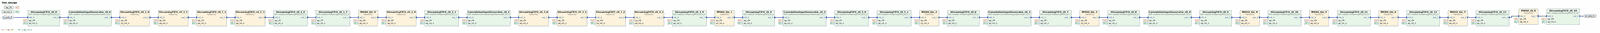
[diagram p0: block diagram of the top level, whole]
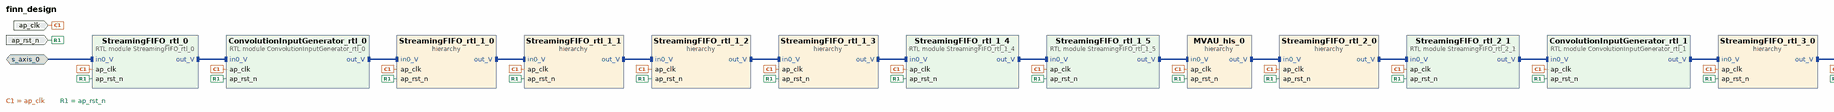
[diagram p1: block diagram of the top level, left part]
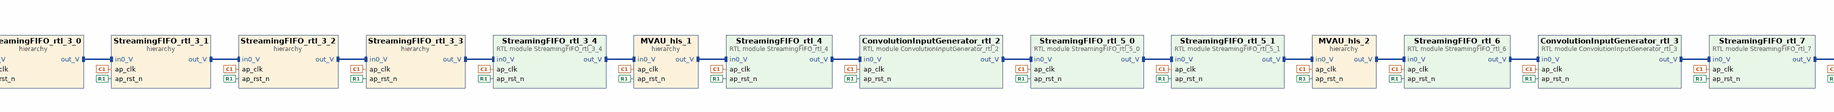
[diagram p2: block diagram of the top level, centre part]
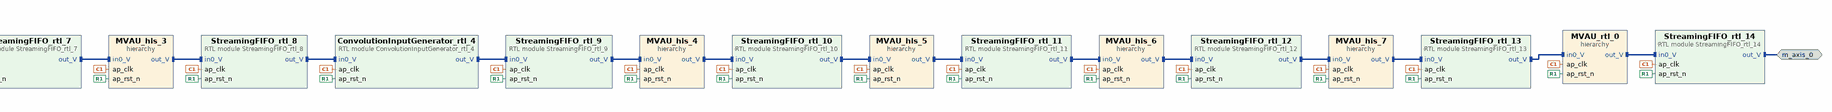
[diagram p3: block diagram of the top level, right part]
# Vivado block design finn_design, xc7s25csga225-1, Vivado 2024.2
create_bd_design finn_design

create_bd_intf_port -mode Slave -vlnv xilinx.com:interface:axis_rtl:1.0 s_axis_0
set_property -dict [list \
  CONFIG.FREQ_HZ 83333333 \
  CONFIG.HAS_TKEEP 0 \
  CONFIG.HAS_TLAST 0 \
  CONFIG.HAS_TREADY 1 \
  CONFIG.HAS_TSTRB 0 \
  CONFIG.LAYERED_METADATA undef \
  CONFIG.TDATA_NUM_BYTES 1 \
  CONFIG.TDEST_WIDTH 0 \
  CONFIG.TID_WIDTH 0 \
  CONFIG.TUSER_WIDTH 0 \
] [get_bd_intf_ports s_axis_0]
create_bd_intf_port -mode Master -vlnv xilinx.com:interface:axis_rtl:1.0 m_axis_0
set_property -dict {CONFIG.FREQ_HZ 83333333} [get_bd_intf_ports m_axis_0]
create_bd_port -dir I -type clk ap_clk
set_property -dict {CONFIG.FREQ_HZ 83333333} [get_bd_ports ap_clk]
create_bd_port -dir I -type rst ap_rst_n

create_bd_cell -type module -reference StreamingFIFO_rtl_0 StreamingFIFO_rtl_0
create_bd_cell -type module -reference ConvolutionInputGenerator_rtl_0 ConvolutionInputGenerator_rtl_0
create_bd_cell -type hier StreamingFIFO_rtl_1_0
create_bd_cell -type hier StreamingFIFO_rtl_1_1
create_bd_cell -type hier StreamingFIFO_rtl_1_2
create_bd_cell -type hier StreamingFIFO_rtl_1_3
create_bd_cell -type module -reference StreamingFIFO_rtl_1_4 StreamingFIFO_rtl_1_4
create_bd_cell -type module -reference StreamingFIFO_rtl_1_5 StreamingFIFO_rtl_1_5
create_bd_cell -type hier MVAU_hls_0
create_bd_cell -type hier StreamingFIFO_rtl_2_0
create_bd_cell -type module -reference StreamingFIFO_rtl_2_1 StreamingFIFO_rtl_2_1
create_bd_cell -type module -reference ConvolutionInputGenerator_rtl_1 ConvolutionInputGenerator_rtl_1
create_bd_cell -type hier StreamingFIFO_rtl_3_0
create_bd_cell -type hier StreamingFIFO_rtl_3_1
create_bd_cell -type hier StreamingFIFO_rtl_3_2
create_bd_cell -type hier StreamingFIFO_rtl_3_3
create_bd_cell -type module -reference StreamingFIFO_rtl_3_4 StreamingFIFO_rtl_3_4
create_bd_cell -type hier MVAU_hls_1
create_bd_cell -type module -reference StreamingFIFO_rtl_4 StreamingFIFO_rtl_4
create_bd_cell -type module -reference ConvolutionInputGenerator_rtl_2 ConvolutionInputGenerator_rtl_2
create_bd_cell -type module -reference StreamingFIFO_rtl_5_0 StreamingFIFO_rtl_5_0
create_bd_cell -type module -reference StreamingFIFO_rtl_5_1 StreamingFIFO_rtl_5_1
create_bd_cell -type hier MVAU_hls_2
create_bd_cell -type module -reference StreamingFIFO_rtl_6 StreamingFIFO_rtl_6
create_bd_cell -type module -reference ConvolutionInputGenerator_rtl_3 ConvolutionInputGenerator_rtl_3
create_bd_cell -type module -reference StreamingFIFO_rtl_7 StreamingFIFO_rtl_7
create_bd_cell -type hier MVAU_hls_3
create_bd_cell -type module -reference StreamingFIFO_rtl_8 StreamingFIFO_rtl_8
create_bd_cell -type module -reference ConvolutionInputGenerator_rtl_4 ConvolutionInputGenerator_rtl_4
create_bd_cell -type module -reference StreamingFIFO_rtl_9 StreamingFIFO_rtl_9
create_bd_cell -type hier MVAU_hls_4
create_bd_cell -type module -reference StreamingFIFO_rtl_10 StreamingFIFO_rtl_10
create_bd_cell -type hier MVAU_hls_5
create_bd_cell -type module -reference StreamingFIFO_rtl_11 StreamingFIFO_rtl_11
create_bd_cell -type hier MVAU_hls_6
create_bd_cell -type module -reference StreamingFIFO_rtl_12 StreamingFIFO_rtl_12
create_bd_cell -type hier MVAU_hls_7
create_bd_cell -type module -reference StreamingFIFO_rtl_13 StreamingFIFO_rtl_13
create_bd_cell -type hier MVAU_rtl_0
create_bd_cell -type module -reference StreamingFIFO_rtl_14 StreamingFIFO_rtl_14

# ---- hierarchy /StreamingFIFO_rtl_1_0 ----
current_bd_instance /StreamingFIFO_rtl_1_0
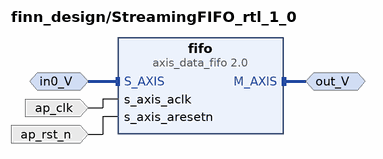
[diagram p4: block diagram inside /StreamingFIFO_rtl_1_0]
create_bd_intf_pin -mode Master -vlnv xilinx.com:interface:axis_rtl:1.0 out_V
create_bd_intf_pin -mode Slave -vlnv xilinx.com:interface:axis_rtl:1.0 in0_V
create_bd_pin -dir I -type clk ap_clk
create_bd_pin -dir I -type rst ap_rst_n

create_bd_cell -type ip -vlnv xilinx.com:ip:axis_data_fifo:2.0 fifo
set_property -dict {CONFIG.FIFO_DEPTH 16384 CONFIG.FIFO_MEMORY_TYPE auto CONFIG.TDATA_NUM_BYTES 1} [get_bd_cells fifo]

# ---- hierarchy /StreamingFIFO_rtl_1_1 ----
current_bd_instance /StreamingFIFO_rtl_1_1
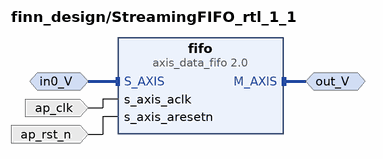
[diagram p5: block diagram inside /StreamingFIFO_rtl_1_1]
create_bd_intf_pin -mode Master -vlnv xilinx.com:interface:axis_rtl:1.0 out_V
create_bd_intf_pin -mode Slave -vlnv xilinx.com:interface:axis_rtl:1.0 in0_V
create_bd_pin -dir I -type clk ap_clk
create_bd_pin -dir I -type rst ap_rst_n

create_bd_cell -type ip -vlnv xilinx.com:ip:axis_data_fifo:2.0 fifo
set_property -dict {CONFIG.FIFO_DEPTH 4096 CONFIG.FIFO_MEMORY_TYPE auto CONFIG.TDATA_NUM_BYTES 1} [get_bd_cells fifo]

# ---- hierarchy /StreamingFIFO_rtl_1_2 ----
current_bd_instance /StreamingFIFO_rtl_1_2
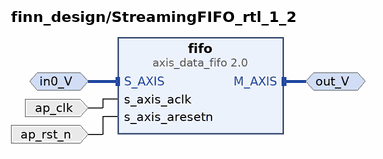
[diagram p6: block diagram inside /StreamingFIFO_rtl_1_2]
create_bd_intf_pin -mode Master -vlnv xilinx.com:interface:axis_rtl:1.0 out_V
create_bd_intf_pin -mode Slave -vlnv xilinx.com:interface:axis_rtl:1.0 in0_V
create_bd_pin -dir I -type clk ap_clk
create_bd_pin -dir I -type rst ap_rst_n

create_bd_cell -type ip -vlnv xilinx.com:ip:axis_data_fifo:2.0 fifo
set_property -dict {CONFIG.FIFO_DEPTH 1024 CONFIG.FIFO_MEMORY_TYPE auto CONFIG.TDATA_NUM_BYTES 1} [get_bd_cells fifo]

# ---- hierarchy /StreamingFIFO_rtl_1_3 ----
current_bd_instance /StreamingFIFO_rtl_1_3
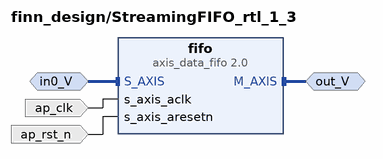
[diagram p7: block diagram inside /StreamingFIFO_rtl_1_3]
create_bd_intf_pin -mode Master -vlnv xilinx.com:interface:axis_rtl:1.0 out_V
create_bd_intf_pin -mode Slave -vlnv xilinx.com:interface:axis_rtl:1.0 in0_V
create_bd_pin -dir I -type clk ap_clk
create_bd_pin -dir I -type rst ap_rst_n

create_bd_cell -type ip -vlnv xilinx.com:ip:axis_data_fifo:2.0 fifo
set_property -dict {CONFIG.FIFO_DEPTH 512 CONFIG.FIFO_MEMORY_TYPE auto CONFIG.TDATA_NUM_BYTES 1} [get_bd_cells fifo]

# ---- hierarchy /MVAU_hls_0 ----
current_bd_instance /MVAU_hls_0
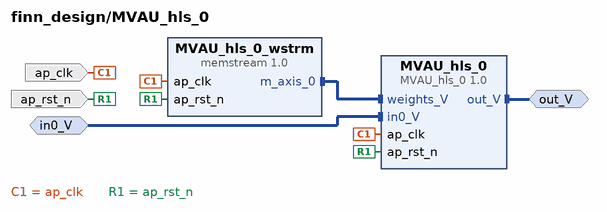
[diagram p8: block diagram inside /MVAU_hls_0]
create_bd_intf_pin -mode Master -vlnv xilinx.com:interface:axis_rtl:1.0 out_V
create_bd_intf_pin -mode Slave -vlnv xilinx.com:interface:axis_rtl:1.0 in0_V
create_bd_pin -dir I -type clk ap_clk
create_bd_pin -dir I -type rst ap_rst_n

create_bd_cell -type ip -vlnv xilinx.com:hls:MVAU_hls_0:1.0 MVAU_hls_0
create_bd_cell -type ip -vlnv amd.com:finn:memstream:1.0 MVAU_hls_0_wstrm
set_property -dict [list \
  CONFIG.DEPTH 300 \
  CONFIG.INIT_FILE /tmp/finn_dev_root/code_gen_ipgen_MVAU_hls_0_9tmw50rx/memblock.dat \
  CONFIG.RAM_STYLE auto \
  CONFIG.WIDTH 8 \
] [get_bd_cells MVAU_hls_0_wstrm]

# ---- hierarchy /StreamingFIFO_rtl_2_0 ----
current_bd_instance /StreamingFIFO_rtl_2_0
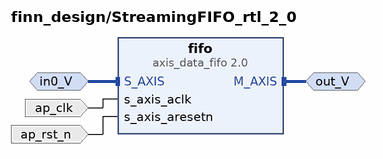
[diagram p9: block diagram inside /StreamingFIFO_rtl_2_0]
create_bd_intf_pin -mode Master -vlnv xilinx.com:interface:axis_rtl:1.0 out_V
create_bd_intf_pin -mode Slave -vlnv xilinx.com:interface:axis_rtl:1.0 in0_V
create_bd_pin -dir I -type clk ap_clk
create_bd_pin -dir I -type rst ap_rst_n

create_bd_cell -type ip -vlnv xilinx.com:ip:axis_data_fifo:2.0 fifo
set_property -dict {CONFIG.FIFO_DEPTH 4096 CONFIG.FIFO_MEMORY_TYPE auto CONFIG.TDATA_NUM_BYTES 1} [get_bd_cells fifo]

# ---- hierarchy /StreamingFIFO_rtl_3_0 ----
current_bd_instance /StreamingFIFO_rtl_3_0
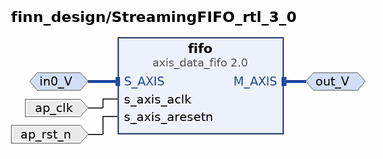
[diagram p10: block diagram inside /StreamingFIFO_rtl_3_0]
create_bd_intf_pin -mode Master -vlnv xilinx.com:interface:axis_rtl:1.0 out_V
create_bd_intf_pin -mode Slave -vlnv xilinx.com:interface:axis_rtl:1.0 in0_V
create_bd_pin -dir I -type clk ap_clk
create_bd_pin -dir I -type rst ap_rst_n

create_bd_cell -type ip -vlnv xilinx.com:ip:axis_data_fifo:2.0 fifo
set_property -dict {CONFIG.FIFO_DEPTH 32768 CONFIG.FIFO_MEMORY_TYPE auto CONFIG.TDATA_NUM_BYTES 1} [get_bd_cells fifo]

# ---- hierarchy /StreamingFIFO_rtl_3_1 ----
current_bd_instance /StreamingFIFO_rtl_3_1
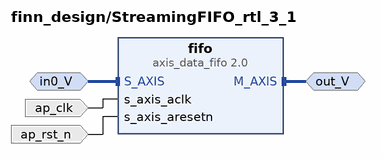
[diagram p11: block diagram inside /StreamingFIFO_rtl_3_1]
create_bd_intf_pin -mode Master -vlnv xilinx.com:interface:axis_rtl:1.0 out_V
create_bd_intf_pin -mode Slave -vlnv xilinx.com:interface:axis_rtl:1.0 in0_V
create_bd_pin -dir I -type clk ap_clk
create_bd_pin -dir I -type rst ap_rst_n

create_bd_cell -type ip -vlnv xilinx.com:ip:axis_data_fifo:2.0 fifo
set_property -dict {CONFIG.FIFO_DEPTH 16384 CONFIG.FIFO_MEMORY_TYPE auto CONFIG.TDATA_NUM_BYTES 1} [get_bd_cells fifo]

# ---- hierarchy /StreamingFIFO_rtl_3_2 ----
current_bd_instance /StreamingFIFO_rtl_3_2
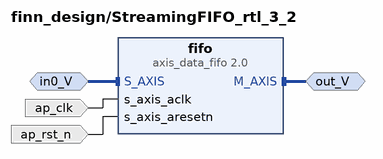
[diagram p12: block diagram inside /StreamingFIFO_rtl_3_2]
create_bd_intf_pin -mode Master -vlnv xilinx.com:interface:axis_rtl:1.0 out_V
create_bd_intf_pin -mode Slave -vlnv xilinx.com:interface:axis_rtl:1.0 in0_V
create_bd_pin -dir I -type clk ap_clk
create_bd_pin -dir I -type rst ap_rst_n

create_bd_cell -type ip -vlnv xilinx.com:ip:axis_data_fifo:2.0 fifo
set_property -dict {CONFIG.FIFO_DEPTH 1024 CONFIG.FIFO_MEMORY_TYPE auto CONFIG.TDATA_NUM_BYTES 1} [get_bd_cells fifo]

# ---- hierarchy /StreamingFIFO_rtl_3_3 ----
current_bd_instance /StreamingFIFO_rtl_3_3
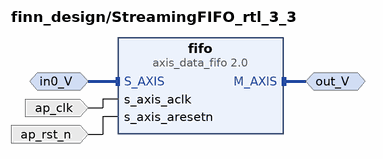
[diagram p13: block diagram inside /StreamingFIFO_rtl_3_3]
create_bd_intf_pin -mode Master -vlnv xilinx.com:interface:axis_rtl:1.0 out_V
create_bd_intf_pin -mode Slave -vlnv xilinx.com:interface:axis_rtl:1.0 in0_V
create_bd_pin -dir I -type clk ap_clk
create_bd_pin -dir I -type rst ap_rst_n

create_bd_cell -type ip -vlnv xilinx.com:ip:axis_data_fifo:2.0 fifo
set_property -dict {CONFIG.FIFO_DEPTH 512 CONFIG.FIFO_MEMORY_TYPE auto CONFIG.TDATA_NUM_BYTES 1} [get_bd_cells fifo]

# ---- hierarchy /MVAU_hls_1 ----
current_bd_instance /MVAU_hls_1
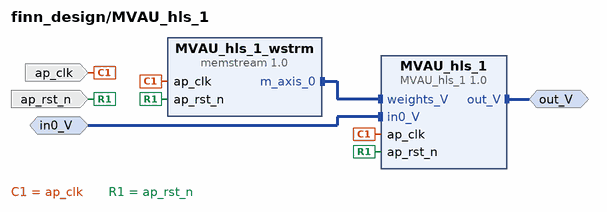
[diagram p14: block diagram inside /MVAU_hls_1]
create_bd_intf_pin -mode Master -vlnv xilinx.com:interface:axis_rtl:1.0 out_V
create_bd_intf_pin -mode Slave -vlnv xilinx.com:interface:axis_rtl:1.0 in0_V
create_bd_pin -dir I -type clk ap_clk
create_bd_pin -dir I -type rst ap_rst_n

create_bd_cell -type ip -vlnv xilinx.com:hls:MVAU_hls_1:1.0 MVAU_hls_1
create_bd_cell -type ip -vlnv amd.com:finn:memstream:1.0 MVAU_hls_1_wstrm
set_property -dict [list \
  CONFIG.DEPTH 5400 \
  CONFIG.INIT_FILE /tmp/finn_dev_root/code_gen_ipgen_MVAU_hls_1_tzf29ljv/memblock.dat \
  CONFIG.RAM_STYLE auto \
  CONFIG.WIDTH 8 \
] [get_bd_cells MVAU_hls_1_wstrm]

# ---- hierarchy /MVAU_hls_2 ----
current_bd_instance /MVAU_hls_2
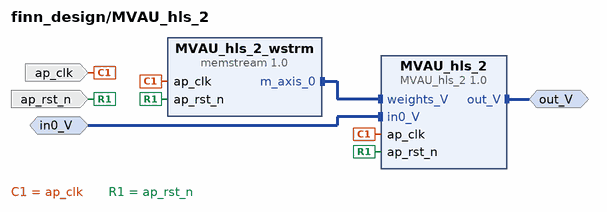
[diagram p15: block diagram inside /MVAU_hls_2]
create_bd_intf_pin -mode Master -vlnv xilinx.com:interface:axis_rtl:1.0 out_V
create_bd_intf_pin -mode Slave -vlnv xilinx.com:interface:axis_rtl:1.0 in0_V
create_bd_pin -dir I -type clk ap_clk
create_bd_pin -dir I -type rst ap_rst_n

create_bd_cell -type ip -vlnv xilinx.com:hls:MVAU_hls_2:1.0 MVAU_hls_2
create_bd_cell -type ip -vlnv amd.com:finn:memstream:1.0 MVAU_hls_2_wstrm
set_property -dict [list \
  CONFIG.DEPTH 10800 \
  CONFIG.INIT_FILE /tmp/finn_dev_root/code_gen_ipgen_MVAU_hls_2_r07ns4_z/memblock.dat \
  CONFIG.RAM_STYLE auto \
  CONFIG.WIDTH 8 \
] [get_bd_cells MVAU_hls_2_wstrm]

# ---- hierarchy /MVAU_hls_3 ----
current_bd_instance /MVAU_hls_3
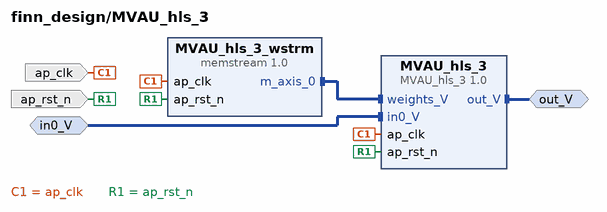
[diagram p16: block diagram inside /MVAU_hls_3]
create_bd_intf_pin -mode Master -vlnv xilinx.com:interface:axis_rtl:1.0 out_V
create_bd_intf_pin -mode Slave -vlnv xilinx.com:interface:axis_rtl:1.0 in0_V
create_bd_pin -dir I -type clk ap_clk
create_bd_pin -dir I -type rst ap_rst_n

create_bd_cell -type ip -vlnv xilinx.com:hls:MVAU_hls_3:1.0 MVAU_hls_3
create_bd_cell -type ip -vlnv amd.com:finn:memstream:1.0 MVAU_hls_3_wstrm
set_property -dict [list \
  CONFIG.DEPTH 6912 \
  CONFIG.INIT_FILE /tmp/finn_dev_root/code_gen_ipgen_MVAU_hls_3_en1zw_ib/memblock.dat \
  CONFIG.RAM_STYLE auto \
  CONFIG.WIDTH 8 \
] [get_bd_cells MVAU_hls_3_wstrm]

# ---- hierarchy /MVAU_hls_4 ----
current_bd_instance /MVAU_hls_4
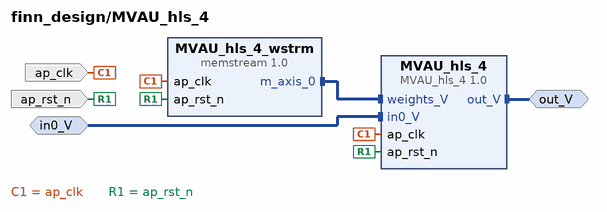
[diagram p17: block diagram inside /MVAU_hls_4]
create_bd_intf_pin -mode Master -vlnv xilinx.com:interface:axis_rtl:1.0 out_V
create_bd_intf_pin -mode Slave -vlnv xilinx.com:interface:axis_rtl:1.0 in0_V
create_bd_pin -dir I -type clk ap_clk
create_bd_pin -dir I -type rst ap_rst_n

create_bd_cell -type ip -vlnv xilinx.com:hls:MVAU_hls_4:1.0 MVAU_hls_4
create_bd_cell -type ip -vlnv amd.com:finn:memstream:1.0 MVAU_hls_4_wstrm
set_property -dict [list \
  CONFIG.DEPTH 9216 \
  CONFIG.INIT_FILE /tmp/finn_dev_root/code_gen_ipgen_MVAU_hls_4_99q9woyy/memblock.dat \
  CONFIG.RAM_STYLE auto \
  CONFIG.WIDTH 8 \
] [get_bd_cells MVAU_hls_4_wstrm]

# ---- hierarchy /MVAU_hls_5 ----
current_bd_instance /MVAU_hls_5
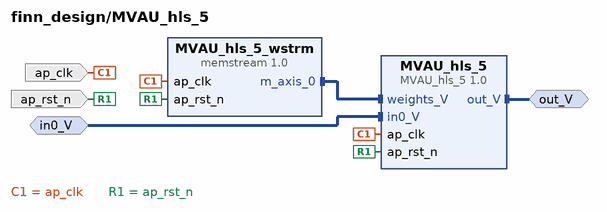
[diagram p18: block diagram inside /MVAU_hls_5]
create_bd_intf_pin -mode Master -vlnv xilinx.com:interface:axis_rtl:1.0 out_V
create_bd_intf_pin -mode Slave -vlnv xilinx.com:interface:axis_rtl:1.0 in0_V
create_bd_pin -dir I -type clk ap_clk
create_bd_pin -dir I -type rst ap_rst_n

create_bd_cell -type ip -vlnv xilinx.com:hls:MVAU_hls_5:1.0 MVAU_hls_5
create_bd_cell -type ip -vlnv amd.com:finn:memstream:1.0 MVAU_hls_5_wstrm
set_property -dict [list \
  CONFIG.DEPTH 1600 \
  CONFIG.INIT_FILE /tmp/finn_dev_root/code_gen_ipgen_MVAU_hls_5_nvq94m66/memblock.dat \
  CONFIG.RAM_STYLE auto \
  CONFIG.WIDTH 8 \
] [get_bd_cells MVAU_hls_5_wstrm]

# ---- hierarchy /MVAU_hls_6 ----
current_bd_instance /MVAU_hls_6
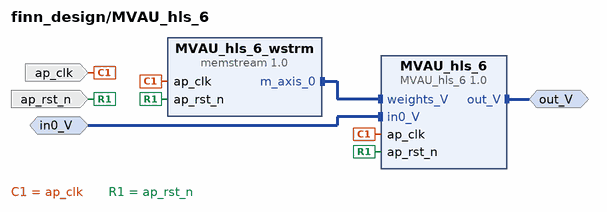
[diagram p19: block diagram inside /MVAU_hls_6]
create_bd_intf_pin -mode Master -vlnv xilinx.com:interface:axis_rtl:1.0 out_V
create_bd_intf_pin -mode Slave -vlnv xilinx.com:interface:axis_rtl:1.0 in0_V
create_bd_pin -dir I -type clk ap_clk
create_bd_pin -dir I -type rst ap_rst_n

create_bd_cell -type ip -vlnv xilinx.com:hls:MVAU_hls_6:1.0 MVAU_hls_6
create_bd_cell -type ip -vlnv amd.com:finn:memstream:1.0 MVAU_hls_6_wstrm
set_property -dict [list \
  CONFIG.DEPTH 1250 \
  CONFIG.INIT_FILE /tmp/finn_dev_root/code_gen_ipgen_MVAU_hls_6_bel7uuog/memblock.dat \
  CONFIG.RAM_STYLE auto \
  CONFIG.WIDTH 8 \
] [get_bd_cells MVAU_hls_6_wstrm]

# ---- hierarchy /MVAU_hls_7 ----
current_bd_instance /MVAU_hls_7
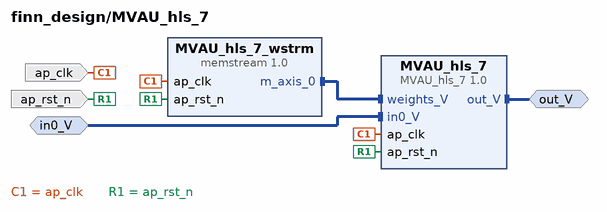
[diagram p20: block diagram inside /MVAU_hls_7]
create_bd_intf_pin -mode Master -vlnv xilinx.com:interface:axis_rtl:1.0 out_V
create_bd_intf_pin -mode Slave -vlnv xilinx.com:interface:axis_rtl:1.0 in0_V
create_bd_pin -dir I -type clk ap_clk
create_bd_pin -dir I -type rst ap_rst_n

create_bd_cell -type ip -vlnv xilinx.com:hls:MVAU_hls_7:1.0 MVAU_hls_7
create_bd_cell -type ip -vlnv amd.com:finn:memstream:1.0 MVAU_hls_7_wstrm
set_property -dict [list \
  CONFIG.DEPTH 125 \
  CONFIG.INIT_FILE /tmp/finn_dev_root/code_gen_ipgen_MVAU_hls_7_ptwujrl6/memblock.dat \
  CONFIG.RAM_STYLE auto \
  CONFIG.WIDTH 8 \
] [get_bd_cells MVAU_hls_7_wstrm]

# ---- hierarchy /MVAU_rtl_0 ----
current_bd_instance /MVAU_rtl_0
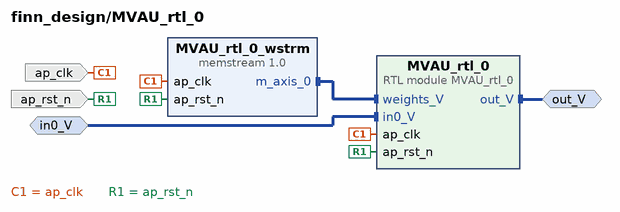
[diagram p21: block diagram inside /MVAU_rtl_0]
create_bd_intf_pin -mode Master -vlnv xilinx.com:interface:axis_rtl:1.0 out_V
create_bd_intf_pin -mode Slave -vlnv xilinx.com:interface:axis_rtl:1.0 in0_V
create_bd_pin -dir I -type clk ap_clk
create_bd_pin -dir I -type rst ap_rst_n

create_bd_cell -type module -reference MVAU_rtl_0 MVAU_rtl_0
create_bd_cell -type ip -vlnv amd.com:finn:memstream:1.0 MVAU_rtl_0_wstrm
set_property -dict [list \
  CONFIG.DEPTH 5 \
  CONFIG.INIT_FILE /tmp/finn_dev_root/code_gen_ipgen_MVAU_rtl_0_8lvb43ez/memblock.dat \
  CONFIG.RAM_STYLE auto \
  CONFIG.WIDTH 8 \
] [get_bd_cells MVAU_rtl_0_wstrm]

# ---- connections ----

current_bd_instance /StreamingFIFO_rtl_1_0
connect_bd_intf_net [get_bd_intf_pins fifo/M_AXIS] [get_bd_intf_pins out_V]
connect_bd_intf_net [get_bd_intf_pins fifo/S_AXIS] [get_bd_intf_pins in0_V]
connect_bd_net [get_bd_pins ap_clk] [get_bd_pins fifo/s_axis_aclk]
connect_bd_net [get_bd_pins ap_rst_n] [get_bd_pins fifo/s_axis_aresetn]

current_bd_instance /StreamingFIFO_rtl_1_1
connect_bd_intf_net [get_bd_intf_pins fifo/M_AXIS] [get_bd_intf_pins out_V]
connect_bd_intf_net [get_bd_intf_pins fifo/S_AXIS] [get_bd_intf_pins in0_V]
connect_bd_net [get_bd_pins ap_clk] [get_bd_pins fifo/s_axis_aclk]
connect_bd_net [get_bd_pins ap_rst_n] [get_bd_pins fifo/s_axis_aresetn]

current_bd_instance /StreamingFIFO_rtl_1_2
connect_bd_intf_net [get_bd_intf_pins fifo/M_AXIS] [get_bd_intf_pins out_V]
connect_bd_intf_net [get_bd_intf_pins fifo/S_AXIS] [get_bd_intf_pins in0_V]
connect_bd_net [get_bd_pins ap_clk] [get_bd_pins fifo/s_axis_aclk]
connect_bd_net [get_bd_pins ap_rst_n] [get_bd_pins fifo/s_axis_aresetn]

current_bd_instance /StreamingFIFO_rtl_1_3
connect_bd_intf_net [get_bd_intf_pins fifo/M_AXIS] [get_bd_intf_pins out_V]
connect_bd_intf_net [get_bd_intf_pins fifo/S_AXIS] [get_bd_intf_pins in0_V]
connect_bd_net [get_bd_pins ap_clk] [get_bd_pins fifo/s_axis_aclk]
connect_bd_net [get_bd_pins ap_rst_n] [get_bd_pins fifo/s_axis_aresetn]

current_bd_instance /MVAU_hls_0
connect_bd_intf_net [get_bd_intf_pins out_V] [get_bd_intf_pins MVAU_hls_0/out_V]
connect_bd_intf_net [get_bd_intf_pins MVAU_hls_0_wstrm/m_axis_0] [get_bd_intf_pins MVAU_hls_0/weights_V]
connect_bd_intf_net [get_bd_intf_pins in0_V] [get_bd_intf_pins MVAU_hls_0/in0_V]
connect_bd_net [get_bd_pins ap_clk] [get_bd_pins MVAU_hls_0_wstrm/ap_clk] [get_bd_pins MVAU_hls_0/ap_clk]
connect_bd_net [get_bd_pins ap_rst_n] [get_bd_pins MVAU_hls_0_wstrm/ap_rst_n] [get_bd_pins MVAU_hls_0/ap_rst_n]

current_bd_instance /StreamingFIFO_rtl_2_0
connect_bd_intf_net [get_bd_intf_pins fifo/M_AXIS] [get_bd_intf_pins out_V]
connect_bd_intf_net [get_bd_intf_pins fifo/S_AXIS] [get_bd_intf_pins in0_V]
connect_bd_net [get_bd_pins ap_clk] [get_bd_pins fifo/s_axis_aclk]
connect_bd_net [get_bd_pins ap_rst_n] [get_bd_pins fifo/s_axis_aresetn]

current_bd_instance /StreamingFIFO_rtl_3_0
connect_bd_intf_net [get_bd_intf_pins fifo/M_AXIS] [get_bd_intf_pins out_V]
connect_bd_intf_net [get_bd_intf_pins fifo/S_AXIS] [get_bd_intf_pins in0_V]
connect_bd_net [get_bd_pins ap_clk] [get_bd_pins fifo/s_axis_aclk]
connect_bd_net [get_bd_pins ap_rst_n] [get_bd_pins fifo/s_axis_aresetn]

current_bd_instance /StreamingFIFO_rtl_3_1
connect_bd_intf_net [get_bd_intf_pins fifo/M_AXIS] [get_bd_intf_pins out_V]
connect_bd_intf_net [get_bd_intf_pins fifo/S_AXIS] [get_bd_intf_pins in0_V]
connect_bd_net [get_bd_pins ap_clk] [get_bd_pins fifo/s_axis_aclk]
connect_bd_net [get_bd_pins ap_rst_n] [get_bd_pins fifo/s_axis_aresetn]

current_bd_instance /StreamingFIFO_rtl_3_2
connect_bd_intf_net [get_bd_intf_pins fifo/M_AXIS] [get_bd_intf_pins out_V]
connect_bd_intf_net [get_bd_intf_pins fifo/S_AXIS] [get_bd_intf_pins in0_V]
connect_bd_net [get_bd_pins ap_clk] [get_bd_pins fifo/s_axis_aclk]
connect_bd_net [get_bd_pins ap_rst_n] [get_bd_pins fifo/s_axis_aresetn]

current_bd_instance /StreamingFIFO_rtl_3_3
connect_bd_intf_net [get_bd_intf_pins fifo/M_AXIS] [get_bd_intf_pins out_V]
connect_bd_intf_net [get_bd_intf_pins fifo/S_AXIS] [get_bd_intf_pins in0_V]
connect_bd_net [get_bd_pins ap_clk] [get_bd_pins fifo/s_axis_aclk]
connect_bd_net [get_bd_pins ap_rst_n] [get_bd_pins fifo/s_axis_aresetn]

current_bd_instance /MVAU_hls_1
connect_bd_intf_net [get_bd_intf_pins out_V] [get_bd_intf_pins MVAU_hls_1/out_V]
connect_bd_intf_net [get_bd_intf_pins MVAU_hls_1_wstrm/m_axis_0] [get_bd_intf_pins MVAU_hls_1/weights_V]
connect_bd_intf_net [get_bd_intf_pins in0_V] [get_bd_intf_pins MVAU_hls_1/in0_V]
connect_bd_net [get_bd_pins ap_clk] [get_bd_pins MVAU_hls_1_wstrm/ap_clk] [get_bd_pins MVAU_hls_1/ap_clk]
connect_bd_net [get_bd_pins ap_rst_n] [get_bd_pins MVAU_hls_1_wstrm/ap_rst_n] [get_bd_pins MVAU_hls_1/ap_rst_n]

current_bd_instance /MVAU_hls_2
connect_bd_intf_net [get_bd_intf_pins out_V] [get_bd_intf_pins MVAU_hls_2/out_V]
connect_bd_intf_net [get_bd_intf_pins MVAU_hls_2_wstrm/m_axis_0] [get_bd_intf_pins MVAU_hls_2/weights_V]
connect_bd_intf_net [get_bd_intf_pins in0_V] [get_bd_intf_pins MVAU_hls_2/in0_V]
connect_bd_net [get_bd_pins ap_clk] [get_bd_pins MVAU_hls_2_wstrm/ap_clk] [get_bd_pins MVAU_hls_2/ap_clk]
connect_bd_net [get_bd_pins ap_rst_n] [get_bd_pins MVAU_hls_2_wstrm/ap_rst_n] [get_bd_pins MVAU_hls_2/ap_rst_n]

current_bd_instance /MVAU_hls_3
connect_bd_intf_net [get_bd_intf_pins out_V] [get_bd_intf_pins MVAU_hls_3/out_V]
connect_bd_intf_net [get_bd_intf_pins MVAU_hls_3_wstrm/m_axis_0] [get_bd_intf_pins MVAU_hls_3/weights_V]
connect_bd_intf_net [get_bd_intf_pins in0_V] [get_bd_intf_pins MVAU_hls_3/in0_V]
connect_bd_net [get_bd_pins ap_clk] [get_bd_pins MVAU_hls_3_wstrm/ap_clk] [get_bd_pins MVAU_hls_3/ap_clk]
connect_bd_net [get_bd_pins ap_rst_n] [get_bd_pins MVAU_hls_3_wstrm/ap_rst_n] [get_bd_pins MVAU_hls_3/ap_rst_n]

current_bd_instance /MVAU_hls_4
connect_bd_intf_net [get_bd_intf_pins out_V] [get_bd_intf_pins MVAU_hls_4/out_V]
connect_bd_intf_net [get_bd_intf_pins MVAU_hls_4_wstrm/m_axis_0] [get_bd_intf_pins MVAU_hls_4/weights_V]
connect_bd_intf_net [get_bd_intf_pins in0_V] [get_bd_intf_pins MVAU_hls_4/in0_V]
connect_bd_net [get_bd_pins ap_clk] [get_bd_pins MVAU_hls_4_wstrm/ap_clk] [get_bd_pins MVAU_hls_4/ap_clk]
connect_bd_net [get_bd_pins ap_rst_n] [get_bd_pins MVAU_hls_4_wstrm/ap_rst_n] [get_bd_pins MVAU_hls_4/ap_rst_n]

current_bd_instance /MVAU_hls_5
connect_bd_intf_net [get_bd_intf_pins out_V] [get_bd_intf_pins MVAU_hls_5/out_V]
connect_bd_intf_net [get_bd_intf_pins MVAU_hls_5_wstrm/m_axis_0] [get_bd_intf_pins MVAU_hls_5/weights_V]
connect_bd_intf_net [get_bd_intf_pins in0_V] [get_bd_intf_pins MVAU_hls_5/in0_V]
connect_bd_net [get_bd_pins ap_clk] [get_bd_pins MVAU_hls_5_wstrm/ap_clk] [get_bd_pins MVAU_hls_5/ap_clk]
connect_bd_net [get_bd_pins ap_rst_n] [get_bd_pins MVAU_hls_5_wstrm/ap_rst_n] [get_bd_pins MVAU_hls_5/ap_rst_n]

current_bd_instance /MVAU_hls_6
connect_bd_intf_net [get_bd_intf_pins out_V] [get_bd_intf_pins MVAU_hls_6/out_V]
connect_bd_intf_net [get_bd_intf_pins MVAU_hls_6_wstrm/m_axis_0] [get_bd_intf_pins MVAU_hls_6/weights_V]
connect_bd_intf_net [get_bd_intf_pins in0_V] [get_bd_intf_pins MVAU_hls_6/in0_V]
connect_bd_net [get_bd_pins ap_clk] [get_bd_pins MVAU_hls_6_wstrm/ap_clk] [get_bd_pins MVAU_hls_6/ap_clk]
connect_bd_net [get_bd_pins ap_rst_n] [get_bd_pins MVAU_hls_6_wstrm/ap_rst_n] [get_bd_pins MVAU_hls_6/ap_rst_n]

current_bd_instance /MVAU_hls_7
connect_bd_intf_net [get_bd_intf_pins out_V] [get_bd_intf_pins MVAU_hls_7/out_V]
connect_bd_intf_net [get_bd_intf_pins MVAU_hls_7_wstrm/m_axis_0] [get_bd_intf_pins MVAU_hls_7/weights_V]
connect_bd_intf_net [get_bd_intf_pins in0_V] [get_bd_intf_pins MVAU_hls_7/in0_V]
connect_bd_net [get_bd_pins ap_clk] [get_bd_pins MVAU_hls_7_wstrm/ap_clk] [get_bd_pins MVAU_hls_7/ap_clk]
connect_bd_net [get_bd_pins ap_rst_n] [get_bd_pins MVAU_hls_7_wstrm/ap_rst_n] [get_bd_pins MVAU_hls_7/ap_rst_n]

current_bd_instance /MVAU_rtl_0
connect_bd_intf_net [get_bd_intf_pins out_V] [get_bd_intf_pins MVAU_rtl_0/out_V]
connect_bd_intf_net [get_bd_intf_pins MVAU_rtl_0_wstrm/m_axis_0] [get_bd_intf_pins MVAU_rtl_0/weights_V]
connect_bd_intf_net [get_bd_intf_pins in0_V] [get_bd_intf_pins MVAU_rtl_0/in0_V]
connect_bd_net [get_bd_pins ap_clk] [get_bd_pins MVAU_rtl_0_wstrm/ap_clk] [get_bd_pins MVAU_rtl_0/ap_clk]
connect_bd_net [get_bd_pins ap_rst_n] [get_bd_pins MVAU_rtl_0_wstrm/ap_rst_n] [get_bd_pins MVAU_rtl_0/ap_rst_n]

current_bd_instance /
connect_bd_intf_net [get_bd_intf_pins ConvolutionInputGenerator_rtl_0/out_V] [get_bd_intf_pins StreamingFIFO_rtl_1_0/in0_V]
connect_bd_intf_net [get_bd_intf_pins ConvolutionInputGenerator_rtl_1/out_V] [get_bd_intf_pins StreamingFIFO_rtl_3_0/in0_V]
connect_bd_intf_net [get_bd_intf_pins ConvolutionInputGenerator_rtl_2/out_V] [get_bd_intf_pins StreamingFIFO_rtl_5_0/in0_V]
connect_bd_intf_net [get_bd_intf_pins ConvolutionInputGenerator_rtl_3/out_V] [get_bd_intf_pins StreamingFIFO_rtl_7/in0_V]
connect_bd_intf_net [get_bd_intf_pins ConvolutionInputGenerator_rtl_4/out_V] [get_bd_intf_pins StreamingFIFO_rtl_9/in0_V]
connect_bd_intf_net [get_bd_intf_pins MVAU_hls_0/out_V] [get_bd_intf_pins StreamingFIFO_rtl_2_0/in0_V]
connect_bd_intf_net [get_bd_intf_pins MVAU_hls_1/out_V] [get_bd_intf_pins StreamingFIFO_rtl_4/in0_V]
connect_bd_intf_net [get_bd_intf_pins MVAU_hls_2/out_V] [get_bd_intf_pins StreamingFIFO_rtl_6/in0_V]
connect_bd_intf_net [get_bd_intf_pins MVAU_hls_3/out_V] [get_bd_intf_pins StreamingFIFO_rtl_8/in0_V]
connect_bd_intf_net [get_bd_intf_pins MVAU_hls_4/out_V] [get_bd_intf_pins StreamingFIFO_rtl_10/in0_V]
connect_bd_intf_net [get_bd_intf_pins MVAU_hls_5/out_V] [get_bd_intf_pins StreamingFIFO_rtl_11/in0_V]
connect_bd_intf_net [get_bd_intf_pins MVAU_hls_6/out_V] [get_bd_intf_pins StreamingFIFO_rtl_12/in0_V]
connect_bd_intf_net [get_bd_intf_pins MVAU_hls_7/out_V] [get_bd_intf_pins StreamingFIFO_rtl_13/in0_V]
connect_bd_intf_net [get_bd_intf_pins MVAU_rtl_0/out_V] [get_bd_intf_pins StreamingFIFO_rtl_14/in0_V]
connect_bd_intf_net [get_bd_intf_pins StreamingFIFO_rtl_0/out_V] [get_bd_intf_pins ConvolutionInputGenerator_rtl_0/in0_V]
connect_bd_intf_net [get_bd_intf_pins StreamingFIFO_rtl_10/out_V] [get_bd_intf_pins MVAU_hls_5/in0_V]
connect_bd_intf_net [get_bd_intf_pins StreamingFIFO_rtl_11/out_V] [get_bd_intf_pins MVAU_hls_6/in0_V]
connect_bd_intf_net [get_bd_intf_pins StreamingFIFO_rtl_12/out_V] [get_bd_intf_pins MVAU_hls_7/in0_V]
connect_bd_intf_net [get_bd_intf_pins StreamingFIFO_rtl_13/out_V] [get_bd_intf_pins MVAU_rtl_0/in0_V]
connect_bd_intf_net [get_bd_intf_ports m_axis_0] [get_bd_intf_pins StreamingFIFO_rtl_14/out_V]
connect_bd_intf_net [get_bd_intf_pins StreamingFIFO_rtl_1_0/out_V] [get_bd_intf_pins StreamingFIFO_rtl_1_1/in0_V]
connect_bd_intf_net [get_bd_intf_pins StreamingFIFO_rtl_1_1/out_V] [get_bd_intf_pins StreamingFIFO_rtl_1_2/in0_V]
connect_bd_intf_net [get_bd_intf_pins StreamingFIFO_rtl_1_2/out_V] [get_bd_intf_pins StreamingFIFO_rtl_1_3/in0_V]
connect_bd_intf_net [get_bd_intf_pins StreamingFIFO_rtl_1_3/out_V] [get_bd_intf_pins StreamingFIFO_rtl_1_4/in0_V]
connect_bd_intf_net [get_bd_intf_pins StreamingFIFO_rtl_1_4/out_V] [get_bd_intf_pins StreamingFIFO_rtl_1_5/in0_V]
connect_bd_intf_net [get_bd_intf_pins StreamingFIFO_rtl_1_5/out_V] [get_bd_intf_pins MVAU_hls_0/in0_V]
connect_bd_intf_net [get_bd_intf_pins StreamingFIFO_rtl_2_0/out_V] [get_bd_intf_pins StreamingFIFO_rtl_2_1/in0_V]
connect_bd_intf_net [get_bd_intf_pins StreamingFIFO_rtl_2_1/out_V] [get_bd_intf_pins ConvolutionInputGenerator_rtl_1/in0_V]
connect_bd_intf_net [get_bd_intf_pins StreamingFIFO_rtl_3_0/out_V] [get_bd_intf_pins StreamingFIFO_rtl_3_1/in0_V]
connect_bd_intf_net [get_bd_intf_pins StreamingFIFO_rtl_3_1/out_V] [get_bd_intf_pins StreamingFIFO_rtl_3_2/in0_V]
connect_bd_intf_net [get_bd_intf_pins StreamingFIFO_rtl_3_2/out_V] [get_bd_intf_pins StreamingFIFO_rtl_3_3/in0_V]
connect_bd_intf_net [get_bd_intf_pins StreamingFIFO_rtl_3_3/out_V] [get_bd_intf_pins StreamingFIFO_rtl_3_4/in0_V]
connect_bd_intf_net [get_bd_intf_pins StreamingFIFO_rtl_3_4/out_V] [get_bd_intf_pins MVAU_hls_1/in0_V]
connect_bd_intf_net [get_bd_intf_pins StreamingFIFO_rtl_4/out_V] [get_bd_intf_pins ConvolutionInputGenerator_rtl_2/in0_V]
connect_bd_intf_net [get_bd_intf_pins StreamingFIFO_rtl_5_0/out_V] [get_bd_intf_pins StreamingFIFO_rtl_5_1/in0_V]
connect_bd_intf_net [get_bd_intf_pins StreamingFIFO_rtl_5_1/out_V] [get_bd_intf_pins MVAU_hls_2/in0_V]
connect_bd_intf_net [get_bd_intf_pins StreamingFIFO_rtl_6/out_V] [get_bd_intf_pins ConvolutionInputGenerator_rtl_3/in0_V]
connect_bd_intf_net [get_bd_intf_pins StreamingFIFO_rtl_7/out_V] [get_bd_intf_pins MVAU_hls_3/in0_V]
connect_bd_intf_net [get_bd_intf_pins StreamingFIFO_rtl_8/out_V] [get_bd_intf_pins ConvolutionInputGenerator_rtl_4/in0_V]
connect_bd_intf_net [get_bd_intf_pins StreamingFIFO_rtl_9/out_V] [get_bd_intf_pins MVAU_hls_4/in0_V]
connect_bd_intf_net -intf_net in0_V_0_1 [get_bd_intf_ports s_axis_0] [get_bd_intf_pins StreamingFIFO_rtl_0/in0_V]
connect_bd_net -net ap_clk_0_1 [get_bd_ports ap_clk] \
  [get_bd_pins StreamingFIFO_rtl_0/ap_clk] [get_bd_pins ConvolutionInputGenerator_rtl_0/ap_clk] \
  [get_bd_pins StreamingFIFO_rtl_1_0/ap_clk] [get_bd_pins StreamingFIFO_rtl_1_1/ap_clk] \
  [get_bd_pins StreamingFIFO_rtl_1_2/ap_clk] [get_bd_pins StreamingFIFO_rtl_1_3/ap_clk] \
  [get_bd_pins StreamingFIFO_rtl_1_4/ap_clk] [get_bd_pins StreamingFIFO_rtl_1_5/ap_clk] [get_bd_pins MVAU_hls_0/ap_clk] \
  [get_bd_pins StreamingFIFO_rtl_2_0/ap_clk] [get_bd_pins StreamingFIFO_rtl_2_1/ap_clk] \
  [get_bd_pins ConvolutionInputGenerator_rtl_1/ap_clk] [get_bd_pins StreamingFIFO_rtl_3_0/ap_clk] \
  [get_bd_pins StreamingFIFO_rtl_3_1/ap_clk] [get_bd_pins StreamingFIFO_rtl_3_2/ap_clk] \
  [get_bd_pins StreamingFIFO_rtl_3_3/ap_clk] [get_bd_pins StreamingFIFO_rtl_3_4/ap_clk] [get_bd_pins MVAU_hls_1/ap_clk] \
  [get_bd_pins StreamingFIFO_rtl_4/ap_clk] [get_bd_pins ConvolutionInputGenerator_rtl_2/ap_clk] \
  [get_bd_pins StreamingFIFO_rtl_5_0/ap_clk] [get_bd_pins StreamingFIFO_rtl_5_1/ap_clk] [get_bd_pins MVAU_hls_2/ap_clk] \
  [get_bd_pins StreamingFIFO_rtl_6/ap_clk] [get_bd_pins ConvolutionInputGenerator_rtl_3/ap_clk] \
  [get_bd_pins StreamingFIFO_rtl_7/ap_clk] [get_bd_pins MVAU_hls_3/ap_clk] [get_bd_pins StreamingFIFO_rtl_8/ap_clk] \
  [get_bd_pins ConvolutionInputGenerator_rtl_4/ap_clk] [get_bd_pins StreamingFIFO_rtl_9/ap_clk] \
  [get_bd_pins MVAU_hls_4/ap_clk] [get_bd_pins StreamingFIFO_rtl_10/ap_clk] [get_bd_pins MVAU_hls_5/ap_clk] \
  [get_bd_pins StreamingFIFO_rtl_11/ap_clk] [get_bd_pins MVAU_hls_6/ap_clk] [get_bd_pins StreamingFIFO_rtl_12/ap_clk] \
  [get_bd_pins MVAU_hls_7/ap_clk] [get_bd_pins StreamingFIFO_rtl_13/ap_clk] [get_bd_pins MVAU_rtl_0/ap_clk] \
  [get_bd_pins StreamingFIFO_rtl_14/ap_clk]
connect_bd_net -net ap_rst_n_0_1 [get_bd_ports ap_rst_n] \
  [get_bd_pins StreamingFIFO_rtl_0/ap_rst_n] [get_bd_pins ConvolutionInputGenerator_rtl_0/ap_rst_n] \
  [get_bd_pins StreamingFIFO_rtl_1_0/ap_rst_n] [get_bd_pins StreamingFIFO_rtl_1_1/ap_rst_n] \
  [get_bd_pins StreamingFIFO_rtl_1_2/ap_rst_n] [get_bd_pins StreamingFIFO_rtl_1_3/ap_rst_n] \
  [get_bd_pins StreamingFIFO_rtl_1_4/ap_rst_n] [get_bd_pins StreamingFIFO_rtl_1_5/ap_rst_n] [get_bd_pins MVAU_hls_0/ap_rst_n] \
  [get_bd_pins StreamingFIFO_rtl_2_0/ap_rst_n] [get_bd_pins StreamingFIFO_rtl_2_1/ap_rst_n] \
  [get_bd_pins ConvolutionInputGenerator_rtl_1/ap_rst_n] [get_bd_pins StreamingFIFO_rtl_3_0/ap_rst_n] \
  [get_bd_pins StreamingFIFO_rtl_3_1/ap_rst_n] [get_bd_pins StreamingFIFO_rtl_3_2/ap_rst_n] \
  [get_bd_pins StreamingFIFO_rtl_3_3/ap_rst_n] [get_bd_pins StreamingFIFO_rtl_3_4/ap_rst_n] [get_bd_pins MVAU_hls_1/ap_rst_n] \
  [get_bd_pins StreamingFIFO_rtl_4/ap_rst_n] [get_bd_pins ConvolutionInputGenerator_rtl_2/ap_rst_n] \
  [get_bd_pins StreamingFIFO_rtl_5_0/ap_rst_n] [get_bd_pins StreamingFIFO_rtl_5_1/ap_rst_n] [get_bd_pins MVAU_hls_2/ap_rst_n] \
  [get_bd_pins StreamingFIFO_rtl_6/ap_rst_n] [get_bd_pins ConvolutionInputGenerator_rtl_3/ap_rst_n] \
  [get_bd_pins StreamingFIFO_rtl_7/ap_rst_n] [get_bd_pins MVAU_hls_3/ap_rst_n] [get_bd_pins StreamingFIFO_rtl_8/ap_rst_n] \
  [get_bd_pins ConvolutionInputGenerator_rtl_4/ap_rst_n] [get_bd_pins StreamingFIFO_rtl_9/ap_rst_n] \
  [get_bd_pins MVAU_hls_4/ap_rst_n] [get_bd_pins StreamingFIFO_rtl_10/ap_rst_n] [get_bd_pins MVAU_hls_5/ap_rst_n] \
  [get_bd_pins StreamingFIFO_rtl_11/ap_rst_n] [get_bd_pins MVAU_hls_6/ap_rst_n] [get_bd_pins StreamingFIFO_rtl_12/ap_rst_n] \
  [get_bd_pins MVAU_hls_7/ap_rst_n] [get_bd_pins StreamingFIFO_rtl_13/ap_rst_n] [get_bd_pins MVAU_rtl_0/ap_rst_n] \
  [get_bd_pins StreamingFIFO_rtl_14/ap_rst_n]

validate_bd_design
save_bd_design
